# Altium project RF_Wattmeter.PrjPcb
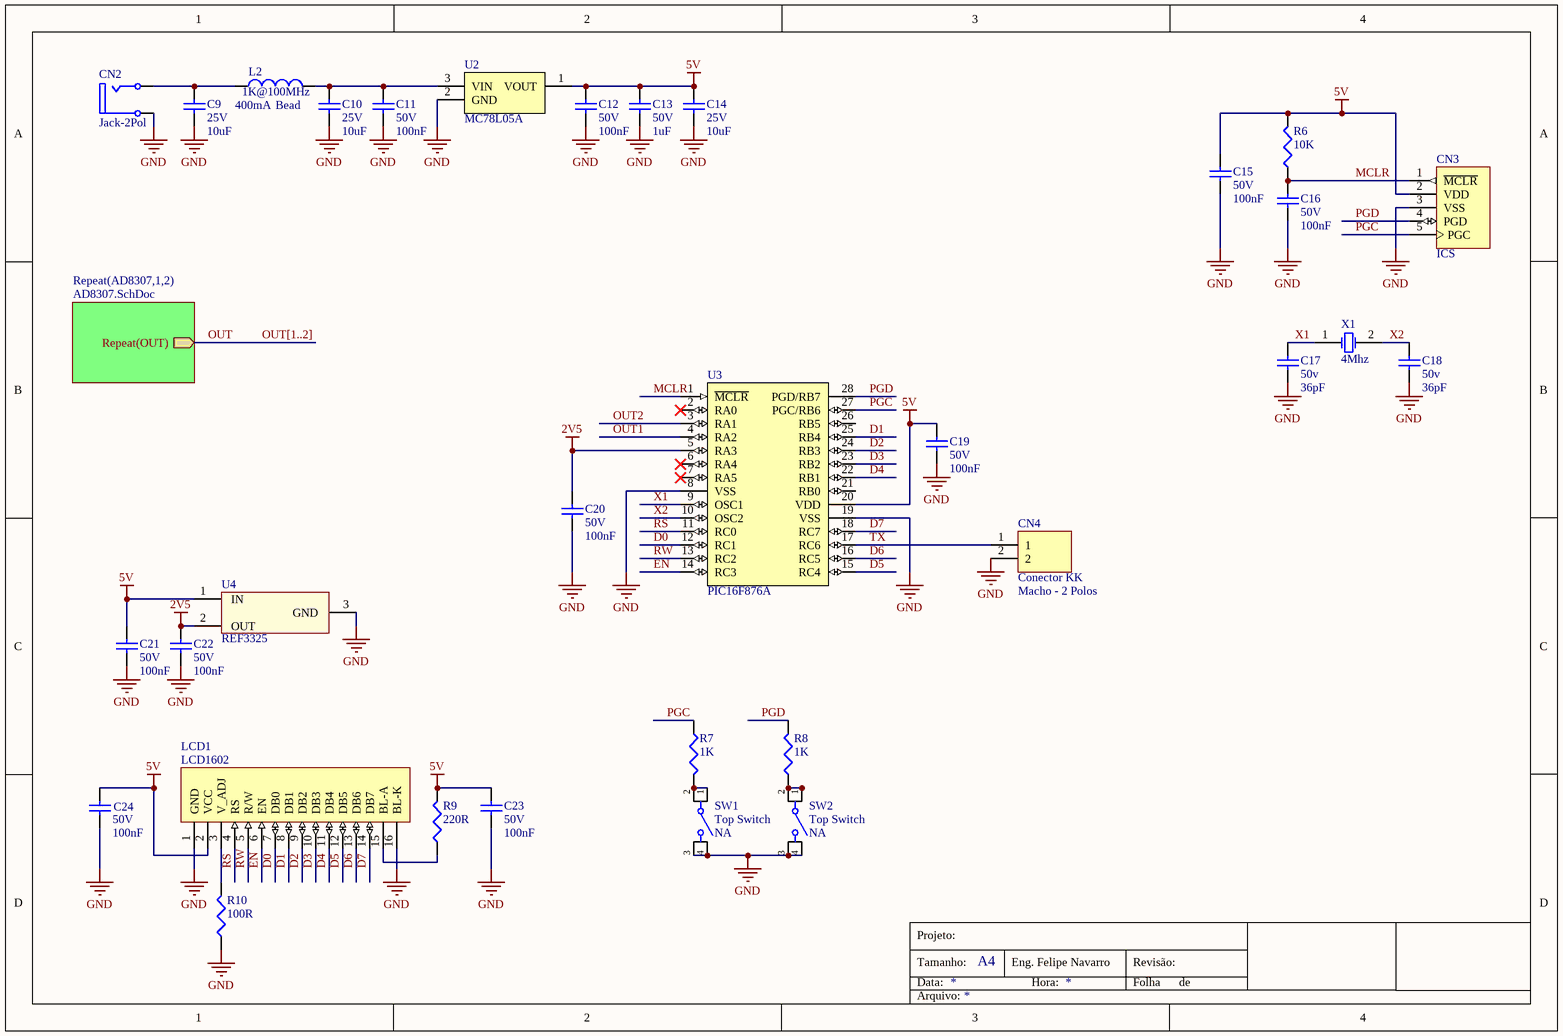
[diagram p0: PIC.SchDoc]
2 sheets, 64 parts. Net scope: hierarchical (ports join the sheet entries above them; power ports are global).
Board file: RF_Wattmeter.PcbDoc
Sheets:
  PIC.SchDoc
    AD83071 = AD8307.SchDoc
    AD83072 = AD8307.SchDoc

## Sheet PIC.SchDoc
size A4; Organization: Altium Limited; Address1: L3, 12a Rodborough Rd; Address2: Frenchs Forest; Address3: NSW; Address4: Australia 2086

### Parts
C9  value 10uF  Tensão: 25V  [CC0805]  (hidden comment: Capacitor Cerâmico)
C10  value 10uF  Tensão: 25V  [CC0805]  (hidden comment: Capacitor Cerâmico)
C11  value 100nF  Tensão: 50V  [CC0603]  (hidden comment: Capacitor Cerâmico)
C12  value 100nF  Tensão: 50V  [CC0603]  (hidden comment: Capacitor Cerâmico)
C13  value 1uF  Tensão: 50V  [CC0603]  (hidden comment: Capacitor Cerâmico)
C14  value 10uF  Tensão: 25V  [CC0805]  (hidden comment: Capacitor Cerâmico)
C15  value 100nF  Tensão: 50V  [CC0603]  (hidden comment: Capacitor Cerâmico)
C16  value 100nF  Tensão: 50V  [CC0603]  (hidden comment: Capacitor Cerâmico)
C17  value 36pF  Tensão: 50v  [CC0603]  (hidden comment: Capacitor Cerâmico)
C18  value 36pF  Tensão: 50v  [CC0603]  (hidden comment: Capacitor Cerâmico)
C19  value 100nF  Tensão: 50V  [CC0603]  (hidden comment: Capacitor Cerâmico)
C20  value 100nF  Tensão: 50V  [CC0603]  (hidden comment: Capacitor Cerâmico)
C21  value 100nF  Tensão: 50V  [CC0603]  (hidden comment: Capacitor Cerâmico)
C22  value 100nF  Tensão: 50V  [CC0603]  (hidden comment: Capacitor Cerâmico)
C23  value 100nF  Tensão: 50V  [CC0603]  (hidden comment: Capacitor Cerâmico)
C24  value 100nF  Tensão: 50V  [CC0603]  (hidden comment: Capacitor Cerâmico)
CN2  Jack-2Pol  [CONN_JACK-FONTE]
CN3  ICS  [CONN HDR1X5]
CN4  Conector KK  value Macho - 2 Polos  [CONN HDR2-POL P.100]
L2  Bead  value 1K@100MHz  Corrente: 400mA  [CC0603]
LCD1  LCD1602  [LCD-1602]
R6  value 10K  [CC0603]  (hidden comment: Resistor)
R7  value 1K  [CC0603]  (hidden comment: Resistor)
R8  value 1K  [CC0603]  (hidden comment: Resistor)
R9  value 220R  [CC0603]  (hidden comment: Resistor)
R10  value 100R  [CC0603]  (hidden comment: Resistor)
SW1  Top Switch  value NA  [SWITCH-TACTIL_6x6]
SW2  Top Switch  value NA  [SWITCH-TACTIL_6x6]
U2  MC78L05A  [SOT-89-3N]
U3  PIC16F876A  [SOIC-28N]
U4  REF3325  [SOT-23-3N]
X1  4Mhz  [HC/49US]

### Sub-sheets
Repeat(AD8307,1,2) = AD8307.SchDoc: Repeat(OUT) (out)

### Nets
2V5: C20.2 C22.2 U3.5(RA3) U4.2(OUT)
5V: C12.2 C13.2 C14.2 C15.2 C19.2 C21.2 C23.2 C24.2 CN3.2(VDD) LCD1.2(VCC) R6.2 R9.2 U2.1(VOUT) U3.20(VDD) U4.1(IN)
GND: C9.1 C10.1 C11.1 C12.1 C13.1 C14.1 C15.1 C16.1 C17.1 C18.1 C19.1 C20.1 C21.1 C22.1 C23.1 C24.1 CN2.2(Malha) CN3.3(VSS) CN4.2 LCD1.1(GND) LCD1.16(BL-K) R10.1 SW1.3 SW1.4 SW2.3 SW2.4 U2.2(GND) U3.8(VSS) U3.19(VSS) U4.3(GND)
D0: LCD1.7(DB0) U3.12(RC1)
D1: LCD1.8(DB1) U3.25(RB4)
D2: LCD1.9(DB2) U3.24(RB3)
D3: LCD1.10(DB3) U3.23(RB2)
D4: LCD1.11(DB4) U3.22(RB1)
D5: LCD1.12(DB5) U3.15(RC4)
D6: LCD1.13(DB6) U3.16(RC5)
D7: LCD1.14(DB7) U3.18(RC7)
EN: LCD1.6(EN) U3.14(RC3)
MCLR: C16.2 CN3.1(~{MCLR}) R6.1 U3.1(~{MCLR})
OUT: sheet Repeat(AD8307,1,2)/Repeat(OUT)
OUT1: U3.4(RA2)  [project net OUT]
OUT2: U3.3(RA1)  [project net OUT]
PGC: CN3.5(PGC) R7.1 U3.27(PGC/RB6)
PGD: CN3.4(PGD) R8.2 U3.28(PGD/RB7)
RS: LCD1.4(RS) U3.11(RC0)
RW: LCD1.5(R/W) U3.13(RC2)
TX: CN4.1 U3.17(RC6)
X1: C17.2 U3.9(OSC1) X1.1(OSC1)
X2: C18.2 U3.10(OSC2) X1.2(OSC2)
NetC9_2: C9.2 CN2.1(Centro) L2.1
NetC10_2: C10.2 C11.2 L2.2 U2.3(VIN)
NetLCD1_3: LCD1.3(V_ADJ) R10.2
NetLCD1_15: LCD1.15(BL-A) R9.1
NetR7_2: R7.2 SW1.1 SW1.2
NetR8_1: R8.1 SW2.1 SW2.2

Not connected (* = marked no-connect by the designer): U3 2(RA0)* 6(RA4)* 7(RA5)* 21(RB0) 26(RB5)

### Buses and harness runs
bus OUT[1..2]

### Notes on the sheet
- Projeto:
- Tamanho:
- Data:
- A4
- Eng. Felipe Navarro
- Hora:
- Revisão:
- Folha
- de
- Arquivo:

### Library data of the parts
C9 C10 C14 = Cap 10uF 25V 0805 X5R: Capacitor (Semiconductor SIM Model); Chinês: Local; ChinesePrice: 0,02620; Corrente: *A; Potência: *W; Obs:: X5R; Tolerância: ±10%; Supplier 1: Digi-Key; Supplier Part Number 1: 587-2985-1-ND; ComponentLink1Description: Datasheet; ComponentLink1URL: D:\Tecnoclade\Datasheet\!DataMissing.pdf
C11 C12 C15 C16 C19-C24 = Cap 100nF 50V 0603 X7R: Capacitor (Semiconductor SIM Model); Chinês: Local; ChinesePrice: 0,00250; Corrente: *A; Potência: *W; Obs:: X7R; Tolerância: ±10%; Supplier 1: Digi-Key; Supplier Part Number 1: 1276-1000-1-ND; ComponentLink1Description: Datasheet; ComponentLink1URL: D:\Tecnoclade\Datasheet\!DataMissing.pdf
C13 = Cap 1uF 50V 0603 X5R: Capacitor (Semiconductor SIM Model); Chinês: Local; ChinesePrice: 0,01100; Corrente: *A; Potência: *W; Obs:: X5R; Tolerância: ±10%; Supplier 1: Digi-Key; Supplier Part Number 1: 587-2400-1-ND; ComponentLink1Description: Datasheet; ComponentLink1URL: D:\Tecnoclade\Datasheet\!DataMissing.pdf
C17 C18 = Cap - $Val $V $Footprint $Classe_1: Capacitor (Semiconductor SIM Model); Chinês: ----; ChinesePrice: 0,00000; Corrente: *A; Potência: *W; Tolerância: ±*%; Supplier 1: Digi-Key; Supplier Part Number 1: 1276-1187-1-ND; Obs:: *; ComponentLink1Description: Datasheet; ComponentLink1URL: D:\Tecnoclade\Datasheet\!DataMissing.pdf
CN2 = Jack-2Pol: Jack Socket, Thru-Hole, Vertical, 2-Conductor Open Circuit; ChinesePrice: 0,00000; Chinês: ----; Value: Receptáculo - 2Pol; Supplier 1: Digi-Key; Corrente: *; Potência: *; Tensão: *; Obs:: *; Tolerância: *; ComponentLink1Description: Datasheet; ComponentLink1URL: D:\Tecnoclade\Datasheet\!DataMissing.pdf; Supplier Part Number 1: CP-037A-ND
CN3 = Header 5 ICS: Header, 5-Pin; ChinesePrice: 0,10000; Chinês: Proved - Local; Value: Barra de 40 pinos - ATENÇÃO; Corrente: *; Potência: *; Supplier 1: Digi-Key; Supplier Part Number 1: A26509-40-ND; Tensão: *; Obs:: *; Tolerância: *; ComponentLink1Description: Datasheet; ComponentLink1URL: D:\Tecnoclade\Datasheet\!DataMissing.pdf
CN4 = KK 2P Macho-V P2.54mm: ChinesePrice: 0,01400; Chinês: Local; Corrente: *; Potência: *; Supplier 1: Digi-Key; Supplier Part Number 1: A19423-ND; Tensão: *; Obs:: *; Tolerância: *; ComponentLink1Description: Datasheet; ComponentLink1URL: D:\Tecnoclade\Datasheet\!DataMissing.pdf
L2 = Bd 1K@100MHz 0603 400mA: ChinesePrice: 0,00000; Chinês: -----; Obs:: Ferrite (0R5); Tolerância: ±25%; Potência: *; Supplier 1: Digi-Key; Supplier Part Number 1: 445-1550-1-ND; Tensão: *; ComponentLink1Description: Datasheet; ComponentLink1URL: D:\Tecnoclade\Datasheet\!DataMissing.pdf; Substituição: 27/06/2014
LCD1 = LCD1602: LCD Generico 16 caracteres X 2 linhas; ChinesePrice: 0,00000; Chinês: ----; Tensão: -0V3 ~ 7V; Value: Display LCD de LED; Obs:: BackLigth = 3V ~ 11V (5V recomendado); Corrente: *; Potência: *; Supplier 1: Digi-Key; Supplier Part Number 1: --LCD; Tolerância: *; ComponentLink1Description: Datasheet; ComponentLink1URL: D:\Tecnoclade\Datasheet\
R6 = Res 10K 1% 0603 1/10W: ChinesePrice: 0,00089; Chinês: Local; Corrente: *A; Potência: 1/10W; Tensão: *V; Tolerância: ±1%; Supplier 1: Digi-Key; Supplier Part Number 1: P10.0KHCT-ND; Obs: *; ComponentLink1Description: Datasheet; ComponentLink1URL: D:\Tecnoclade\Datasheet\!DataMissing.pdf
R7 R8 = Res 1K 1% 0603 1/10W: ChinesePrice: 0,00089; Chinês: Local; Corrente: *A; Potência: 1/10W; Tensão: *V; Tolerância: ±1%; Supplier 1: Digi-Key; Supplier Part Number 1: RMCF0603FT1K00CT-ND; Obs: *; ComponentLink1Description: Datasheet; ComponentLink1URL: D:\Tecnoclade\Datasheet\!DataMissing.pdf
R9 R10 = Res 220R 1% 0603 1/10W: ChinesePrice: 0,00000; Chinês: ----; Corrente: *A; Potência: 1/10W; Tensão: *V; Obs: ±100ppm/ºC; Tolerância: ±1%; Supplier 1: Digi-Key; Supplier Part Number 1: RMCF0603FT220RCT-ND; ComponentLink1Description: Datasheet; ComponentLink1URL: D:\Tecnoclade\Datasheet\!DataMissing.pdf
SW1 SW2 = SW-SPST Tactil: Single-Pole, Single-Throw Switch; Corrente: 50mA; Tensão: 12V; ChinesePrice: 0,03000; Chinês: Local; Obs:: Atuador = 13mm(h) X 6mm (dia); Supplier 1: Digi-Key; Supplier Part Number 1: 450-1642-ND; Potência: *; Tolerância: *; ComponentLink1Description: Datasheet; ComponentLink1URL: D:\Tecnoclade\Datasheet\!DataMissing.pdf
U2 = MC78L05: Regulador Linear 5V; Chinês: -----; Corrente: 100mA; ChinesePrice: 0,00000; Potência: *; Value: *; Supplier 1: Digi-Key; Supplier Part Number 1: MC78L05ACHXCT-ND; Tensão: 5V; Obs:: *; Tolerância: *; ComponentLink1Description: Datasheet; ComponentLink1URL: D:\Tecnoclade\Datasheet\
U3 = PIC16F876A: Microcontrolador PIC; ChinesePrice: 0,00000; Chinês: ----; Tensão: 2V3 ~ 5V5; Corrente: *; Potência: *; Value: *; Supplier 1: Digi-Key; Supplier Part Number 1: PIC16F876A-I/SO-ND; Obs:: *; Tolerância: *; ComponentLink1Description: Datasheet; ComponentLink1URL: http://ww1.microchip.com/downloads/en/DeviceDoc/40001579E.pdf
U4 = REF3325: IC VREF SERIES 2.5V; Supplier 1: Digi-Key; Supplier Part Number 1: 296-22641-1-ND
X1 = XTAL: Crystal Oscillator; ChinesePrice: 0,00000; Chinês: ----; Value: 20pF/40R; Corrente: *; Potência: *; Supplier 1: Digi-Key; Supplier Part Number 1: 535-10226-1-ND; Tensão: *; Obs:: *; Tolerância: *

## Sheet AD8307.SchDoc
size A4; Organization: Altium Limited; Address1: L3, 12a Rodborough Rd; Address2: Frenchs Forest; Address3: NSW; Address4: Australia 2086
Used 2 times, as channels AD83071, AD83072. Parts and nets are listed once, with the designators drawn on the sheet.
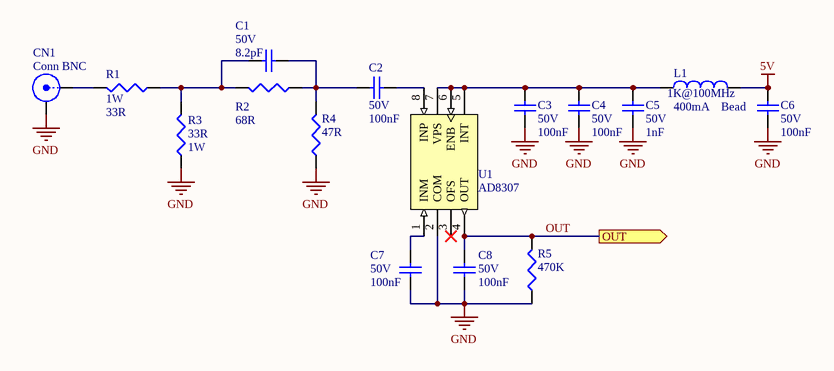
[diagram p1: AD8307.SchDoc]

### Parts
C1  value 8.2pF  Tensão: 50V  [CC0603]  (hidden comment: Capacitor Cerâmico)
C2  value 100nF  Tensão: 50V  [CC0603]  (hidden comment: Capacitor Cerâmico)
C3  value 100nF  Tensão: 50V  [CC0603]  (hidden comment: Capacitor Cerâmico)
C4  value 100nF  Tensão: 50V  [CC0603]  (hidden comment: Capacitor Cerâmico)
C5  value 1nF  Tensão: 50V  [CC0603]  (hidden comment: Capacitor Cerâmico)
C6  value 100nF  Tensão: 50V  [CC0603]  (hidden comment: Capacitor Cerâmico)
C7  value 100nF  Tensão: 50V  [CC0603]  (hidden comment: Capacitor Cerâmico)
C8  value 100nF  Tensão: 50V  [CC0603]  (hidden comment: Capacitor Cerâmico)
CN1  Conn BNC  [CONN BNC-JACK-TE-5-1634556-0]
L1  Bead  value 1K@100MHz  Corrente: 400mA  [CC0603]
R1  value 33R  Potência: 1W  [CC2512]  (hidden comment: Resistor)
R2  value 68R  [CC0603]  (hidden comment: Resistor)
R3  value 33R  Potência: 1W  [CC2512]  (hidden comment: Resistor)
R4  value 47R  [CC0603]  (hidden comment: Resistor)
R5  value 470K  [CC0603]  (hidden comment: Resistor)
U1  AD8307  [SOIC-8N]

### Ports
OUT (out)

### Nets
5V: C6.2 L1.2
GND: C3.1 C4.1 C5.1 C6.1 C7.1 C8.1 CN1.2(Y) R3.1 R4.1 R5.1 U1.2(COM)
OUT: C8.2 R5.2 U1.4(OUT) ; port OUT
NetC1_1: C1.1 R1.1 R2.2 R3.2
NetC1_2: C1.2 C2.1 R2.1 R4.2
NetC2_2: C2.2 U1.8(INP)
NetC3_2: C3.2 C4.2 C5.2 L1.1 U1.5(INT) U1.6(ENB) U1.7(VPS)
NetC7_2: C7.2 U1.1(INM)
NetCN1_1: CN1.1(X) R1.2

Not connected (* = marked no-connect by the designer): U1 3(OFS)*

### Channels
AD83071: designators end in .1; ports OUT=OUT
AD83072: designators end in .2; ports OUT=OUT

### Notes on the sheet
- Projeto:
- Tamanho:
- Data:
- A4
- Eng. Felipe Navarro
- Hora:
- Revisão:
- Folha
- de
- Arquivo:

### Library data of the parts
C1 = Cap 8.2nF 50V 0603 X7R: Capacitor (Semiconductor SIM Model); Chinês: Local; ChinesePrice: 0,00200; Corrente: *A; Potência: *W; Obs:: X7R; Tolerância: ±10%; Supplier 1: Digi-Key; Supplier Part Number 1: 1276-2119-1-ND; ComponentLink1Description: Datasheet; ComponentLink1URL: D:\Tecnoclade\Datasheet\!DataMissing.pdf
C2-C4 C6-C8 = Cap 100nF 50V 0603 X7R: as C11 on sheet PIC; Supplier 1: Digi-Key; Supplier Part Number 1: 1276-1000-1-ND; ComponentLink1Description: Datasheet; ComponentLink1URL: D:\Tecnoclade\Datasheet\!DataMissing.pdf
C5 = Cap 1nF 50V 0603 X7R: Capacitor (Semiconductor SIM Model); Chinês: -----; ChinesePrice: 0,00000; Corrente: *A; Potência: *W; Obs:: X7R; Tolerância: ±10%; Supplier 1: Digi-Key; Supplier Part Number 1: 1276-1916-1-ND; ComponentLink1Description: Datasheet; ComponentLink1URL: D:\Tecnoclade\Datasheet\!DataMissing.pdf
CN1 = Conn BNC: Conector BNC; ChinesePrice: 0,00000; Chinês: ----; Value: Jack BNC; Corrente: *; Potência: *; Supplier 1: Digi-Key; Supplier Part Number 1: A97570-ND; Tensão: *; Obs:: *; Tolerância: *; ComponentLink1Description: Datasheet; ComponentLink1URL: D:\Tecnoclade\Datasheet\!DataMissing.pdf
L1 = Bd 1K@100MHz 0603 400mA: as L2 on sheet PIC; Potência: *; Supplier 1: Digi-Key; Supplier Part Number 1: 445-1550-1-ND; Tensão: *; ComponentLink1Description: Datasheet; ComponentLink1URL: D:\Tecnoclade\Datasheet\!DataMissing.pdf; Substituição: 27/06/2014
R1 R3 = Res 33R 1% 0603 1/10W: ChinesePrice: 0,00000; Chinês: ----; Corrente: *A; Tensão: *V; Obs: ±100ppm/ºC; Tolerância: ±1%; Supplier 1: Digi-Key; Supplier Part Number 1: RMCF2512JT33R0CT-ND; ComponentLink1Description: Datasheet; ComponentLink1URL: D:\Tecnoclade\Datasheet\!DataMissing.pdf
R2 R4 = Res 1K 1% 0603 1/10W: as R7 on sheet PIC; Supplier 1: Digi-Key; Supplier Part Number 1: RMCF0603FT1K00CT-ND; Obs: *; ComponentLink1Description: Datasheet; ComponentLink1URL: D:\Tecnoclade\Datasheet\!DataMissing.pdf
R5 = Res 470K 1% 0603 1/10W: ChinesePrice: 0,00000; Chinês: ----; Corrente: *A; Potência: 1/10W; Tensão: *V; Obs: ±100ppm/ºC; Tolerância: ±1%; Supplier 1: Digi-Key; Supplier Part Number 1: RMCF0603FT470KCT-ND; ComponentLink1Description: Datasheet; ComponentLink1URL: D:\Tecnoclade\Datasheet\!DataMissing.pdf
U1 = AD8307: Low Cost, DC to 500 MHz, 92 dB Log Amp; ChinesePrice: 1,94000; Chinês: Local; Value: Memória; Corrente: *; Potência: *; Supplier 1: Digi-Key; Supplier Part Number 1: AD8307ARZ-REELCT-ND; Tensão: *; Obs:: *; Tolerância: *; ComponentLink1Description: Datasheet; ComponentLink1URL: D:\Tecnoclade\Datasheet\!DataMissing.pdf

## Nets that join several sheets
5V: PIC (15 pins), AD83071 (C6.1.2 L1.1.2), AD83072 (C6.2.2 L1.2.2)
GND: PIC (30 pins), AD83071 (11 pins), AD83072 (11 pins)
OUT: PIC (U3.3), AD83072 (C8.2.2 R5.2.2 U1.2.4)
OUT: PIC (U3.4), AD83071 (C8.1.2 R5.1.2 U1.1.4)